# EasyEDA Pro project ProPrj_Wifi-Adapter_2026-02-01.epro

# Schematic Schematic1
Board Name: Board1; Create Date: 2026-01-29; Page Name: P1; Project Name: Wifi-Adapter; Schematic Name: Schematic1; Update Date: 2026-01-30; Company: EasyEDA.com; Page Size: A4; Version: V1.0
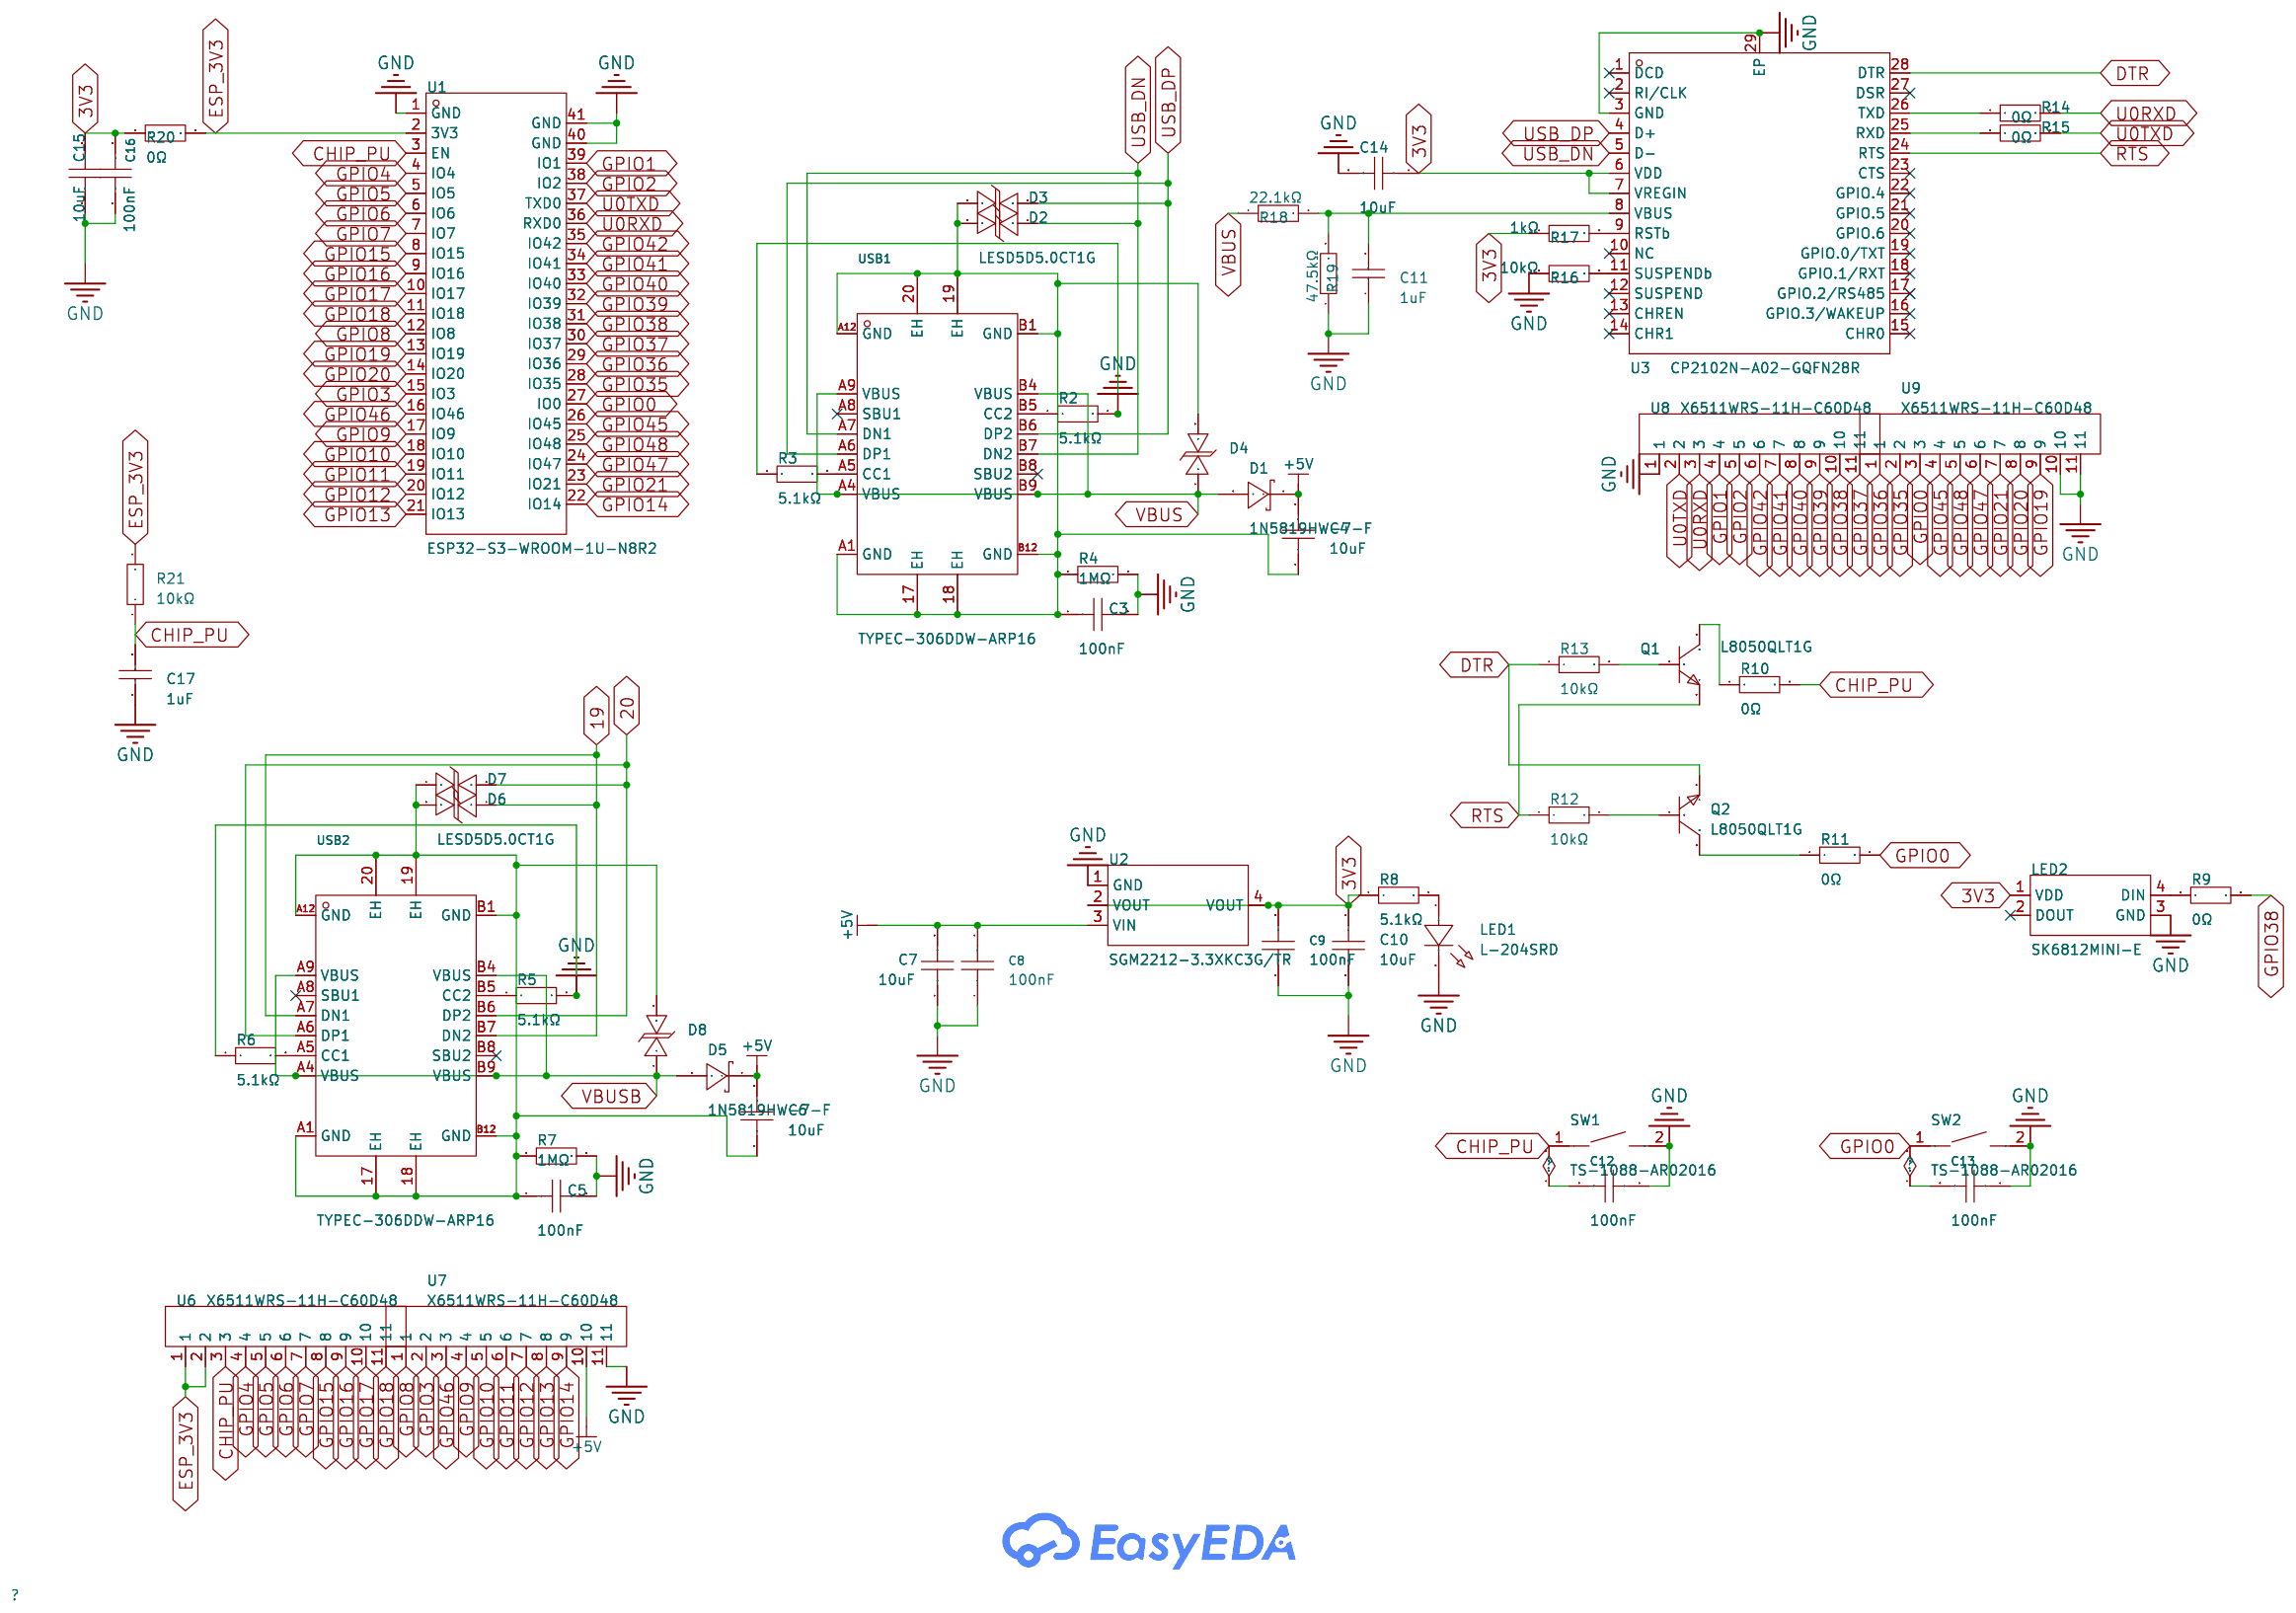
[diagram p0: schematic sheet]

## Parts
C3  100nF  [C0603]
C4  10uF  [C0603]
C5  100nF  [C0603]
C6  10uF  [C0603]
C7  10uF  [C0603]
C8  100nF  [C0603]
C9  100nF  [C0603]
C10  10uF  [C0603]
C11  1uF  [C0603]
C12  100nF  [C0603]
C13  100nF  [C0603]
C14  10uF  [C0603]
C15  10uF  [C0603]
C16  100nF  [C0603]
C17  1uF  [C0603]
D1  1N5819HW-7-F  [SOD-123_L2.7-W1.6-LS3.7-RD]
D2  LESD5D5.0CT1G  [SOD-523_L1.2-W0.8-LS1.6-BI]
D3  LESD5D5.0CT1G  [SOD-523_L1.2-W0.8-LS1.6-BI]
D4  LESD5D5.0CT1G  [SOD-523_L1.2-W0.8-LS1.6-BI]
D5  1N5819HW-7-F  [SOD-123_L2.7-W1.6-LS3.7-RD]
D6  LESD5D5.0CT1G  [SOD-523_L1.2-W0.8-LS1.6-BI]
D7  LESD5D5.0CT1G  [SOD-523_L1.2-W0.8-LS1.6-BI]
D8  LESD5D5.0CT1G  [SOD-523_L1.2-W0.8-LS1.6-BI]
LED1  L-204SRD  [LED-TH_L3.3-W2.4-P2.54-FD_RED]
LED2  SK6812MINI-E  [LED-SMD_L3.2-W2.8-LS5.9_SK6812MINI-E]
Q1  L8050QLT1G  [SOT-23-3_L2.9-W1.3-P1.90-LS2.4-BR]
Q2  L8050QLT1G  [SOT-23-3_L2.9-W1.3-P1.90-LS2.4-BR]
R2  5.1kΩ  [R0603]
R3  5.1kΩ  [R0603]
R4  1MΩ  [R0603]
R5  5.1kΩ  [R0603]
R6  5.1kΩ  [R0603]
R7  1MΩ  [R0603]
R8  5.1kΩ  [R0603]
R9  0Ω  [R0603]
R10  0Ω  [R0603]
R11  0Ω  [R0603]
R12  10kΩ  [R0603]
R13  10kΩ  [R0603]
R14  0Ω  [R0603]
R15  0Ω  [R0603]
R16  10kΩ  [R0603]
R17  1kΩ  [R0603]
R18  22.1kΩ  [R0603]
R19  47.5kΩ  [R0603]
R20  0Ω  [R0603]
R21  10kΩ  [R0603]
SW1  TS-1088-AR02016  [SW-SMD_L3.9-W3.0-P4.45]
SW2  TS-1088-AR02016  [SW-SMD_L3.9-W3.0-P4.45]
U1  ESP32-S3-WROOM-1U-N8R2  [WIRELM-SMD_ESP32-S3-WROOM-1U]
U2  SGM2212-3.3XKC3G/TR  [SOT-223-3_L6.5-W3.4-P2.30-LS7.0-BR]
U3  CP2102N-A02-GQFN28R  [QFN-28_L5.0-W5.0-P0.50-TL-EP3.3]
U6  X6511WRS-11H-C60D48  [HDR-SMD_11P-P2.54-H-M-W13.3-N]
U7  X6511WRS-11H-C60D48  [HDR-SMD_11P-P2.54-H-M-W13.3-N]
U8  X6511WRS-11H-C60D48  [HDR-SMD_11P-P2.54-H-M-W13.3-N]
U9  X6511WRS-11H-C60D48  [HDR-SMD_11P-P2.54-H-M-W13.3-N]
USB1  TYPEC-306DDW-ARP16  [USB-C-TH_TYPEC-306DDW-ARP16]
USB2  TYPEC-306DDW-ARP16  [USB-C-TH_TYPEC-306DDW-ARP16]

## Library data of the parts
C3 C5 = CC0603KRX7R9BB104: Capacitance:100nF Tolerance:±10% Tolerance:±10% Voltage Rating:50V Temperature Coefficient:X7R; LCSC Part Name: 100nF ±10% 50V; Supplier Part: C14663; Manufacturer: YAGEO(国巨); Supplier Footprint: 0603; Datasheet: https://item.szlcsc.com/datasheet/CC0603KRX7R9BB104/15331.html; Supplier: LCSC; Tolerance: ±10%; Voltage Rating: 50V; Temperature Coefficient: X7R
C4 C6 C7 C10 C14 C15 = CC0603MRX5R8BB106: Capacitance:10uF Tolerance:±20% Tolerance:±20% Voltage Rating:25V Temperature Coefficient:X5R; LCSC Part Name: 10uF ±20% 25V; Supplier Part: C596327; Manufacturer: YAGEO(国巨); Supplier Footprint: 0603; Datasheet: https://item.szlcsc.com/datasheet/CC0603MRX5R8BB106/624311.html; Supplier: LCSC; Tolerance: ±20%; Voltage Rating: 25V; Temperature Coefficient: X5R
C8 C9 C12 C13 C16 = CL10B104KB8NNNC: Capacitance:100nF Tolerance:±10% Tolerance:±10% Voltage Rating:50V Temperature Coefficient:X7R; LCSC Part Name: 100nF ±10% 50V; Supplier Part: C1591; Manufacturer: SAMSUNG(三星); Supplier Footprint: 0603; JLCPCB Part Class: Extended Part; Datasheet: https://item.szlcsc.com/datasheet/CL10B104KB8NNNC/1943.html; Supplier: LCSC; Tolerance: ±10%; Voltage Rating: 50V; Temperature Coefficient: X7R
C11 C17 = CL10B105KO8NNNC: Capacitance:1uF Tolerance:±10% Tolerance:±10% Voltage Rating:16V Temperature Coefficient:X7R; LCSC Part Name: 1uF ±10% 16V; Supplier Part: C59782; Manufacturer: SAMSUNG(三星); Supplier Footprint: 0603; Datasheet: https://item.szlcsc.com/datasheet/CL10B105KO8NNNC/60834.html; Supplier: LCSC; Tolerance: ±10%; Voltage Rating: 16V; Temperature Coefficient: X7R
D1 D5 = 1N5819HW-7-F: Diode Configuration:1 Independent Voltage - Forward(Vf@If):450mV@1A Voltage - DC Reverse(Vr):40V Current - Rectified:1A Reverse Leakage Current (Ir):1mA@40V Operating Junction Temperature Range:-65℃~+150℃ Operating Junction Temperature Range:-65℃~+150℃ No; LCSC Part Name: 电压:40V 电流:1A; Supplier Part: C82544; Manufacturer: DIODES(美台); Supplier Footprint: SOD-123; Datasheet: https://item.szlcsc.com/datasheet/1N5819HW-7-F/83701.html; Supplier: LCSC; Diode Configuration: 1 Independent; Voltage - Forward(Vf@If): 450mV@1A; Voltage - DC Reverse(Vr): 40V; Current - Rectified: 1A; Reverse Leakage Current (Ir): 1mA@40V; Operating Junction Temperature Range: -65℃~+150℃; Non-Repetitive Peak Forward Surge Current: 25A
D2-D4 D6-D8 = LESD5D5.0CT1G_C5199850: Supplier Part: C5199850; Manufacturer: UMW(友台半导体); Supplier Footprint: SOD-523; Datasheet: https://atta.szlcsc.com/upload/public/pdf/source/20231109/3A3F4A5EA6FBA8B622F70BA286F4E0C0.pdf; Supplier: LCSC
LED1 = L-204SRD: Lamp Holder Type:1.8mm Tower-shaped Lamp Head Emitted Color:Red Power Dissipation:70mW Forward Current:20mA Dominant Wavelength:645nm Dominant Wavelength:645nm Peak Wavelength:- Diode Configuration:- Lens Color:Foggy red lens Color Temperature:- Color Tem; LCSC Part Name: 红灯; Supplier Part: C2917798; Manufacturer: PARALIGHT(光鼎); Supplier Footprint: 插件,D=1.8mm; Datasheet: https://atta.szlcsc.com/upload/public/pdf/source/20211112/BA2AAE09A121FB6B7F25C10C77270210.pdf; Supplier: LCSC; Lamp Holder Type: 1.8mm Tower-shaped Lamp Head; Emitted Color: Red; Power Dissipation: 70mW; Forward Current: 20mA; Dominant Wavelength: 645nm; Lens Color: Foggy red lens; Viewing Angle: 60°; Operating Temperature: -40℃~+85℃
LED2 = SK6812MINI-E_C5149201: Supplier Part: C5149201; Manufacturer: 欧思科光电; Supplier Footprint: SMD; Datasheet: https://item.szlcsc.com/datasheet/SK6812MINI-E/5773397.html; Supplier: LCSC
Q1 Q2 = L8050QLT1G: type:NPN Current - Collector(Ic):800mA Collector - Emitter Voltage VCEO:25V Pd - Power Dissipation:225mW DC Current Gain:100@100mA,1V DC Current Gain:100@100mA,1V Current - Collector Cutoff:150nA Vce Saturation(VCE(sat)):500mV Operating Temperature:-55℃~+; LCSC Part Name: NPN 电流:800mA 电压:25V; Supplier Part: C49581; Manufacturer: LRC(乐山无线电); Supplier Footprint: SOT-23; Datasheet: https://item.szlcsc.com/datasheet/L8050QLT1G/50589.html; Supplier: LCSC; type: NPN; Current - Collector(Ic): 800mA; Collector - Emitter Voltage VCEO: 25V; Pd - Power Dissipation: 225mW; DC Current Gain: 100@100mA,1V; Current - Collector Cutoff: 150nA; Vce Saturation(VCE(sat)): 500mV; Operating Temperature: -55℃~+150℃; Emitter-Base Voltage(Vebo): 5V
R2 R3 R5 R6 R8 = RT0603BRD075K1L: Type:Thin Film Resistor Resistance: Tolerance:±0.1% Tolerance:±0.1% Power(Watts): Overload Voltage (Max): Temperature Coefficient:±25ppm/℃ Temperature Coefficient:±25ppm/℃ Operating Temperature Range:-55℃~+155℃ Operating Temperature Range:-55℃~+155℃; LCSC Part Name: 薄膜电阻 5.1kΩ ±0.1% 100mW; Supplier Part: C122969; Manufacturer: YAGEO(国巨); Supplier Footprint: 0603; Datasheet: https://atta.szlcsc.com/upload/public/pdf/source/20170728/C122969_1501225761505848820.pdf; Supplier: LCSC; Type: Thin Film Resistor; Tolerance: ±0.1%; Temperature Coefficient: ±25ppm/℃; Operating Temperature Range: -55℃~+155℃
R4 R7 = RC0603FR-071ML: Type:Thick Film Resistors Resistance: Tolerance:±1% Tolerance:±1% Power(Watts): Overload Voltage (Max): Temperature Coefficient:±100ppm/℃ Temperature Coefficient:±100ppm/℃ Operating Temperature Range:-55℃~+155℃ Operating Temperature Range:-55℃~+155℃; LCSC Part Name: 厚膜电阻 1MΩ ±1% 100mW; Supplier Part: C105578; Manufacturer: YAGEO(国巨); Supplier Footprint: 0603; Datasheet: https://atta.szlcsc.com/upload/public/pdf/source/20181102/C105578_67A9388250AF143DE4682E62257D2969.pdf; Supplier: LCSC; Type: Thick Film Resistors; Tolerance: ±1%; Temperature Coefficient: ±100ppm/℃; Operating Temperature Range: -55℃~+155℃
R9-R11 R14 R15 R20 = RC0603FR-070RL: Type:Thick Film Resistors Resistance:0Ω Tolerance:±1% Tolerance:±1% Power(Watts):100mW Voltage-Supply(Max):75V Temperature Coefficient:- Temperature Coefficient:- Operating Temperature:-55℃~+155℃ Operating Temperature:-55℃~+155℃; LCSC Part Name: 厚膜电阻 0Ω ±1% 100mW; Supplier Part: C100044; Manufacturer: YAGEO(国巨); Supplier Footprint: 0603; Datasheet: https://item.szlcsc.com/datasheet/RC0603FR-070RL/101258.html; Supplier: LCSC; Type: Thick Film Resistors; Tolerance: ±1%; Power(Watts): 100mW; Voltage-Supply(Max): 75V; Operating Temperature: -55℃~+155℃
R12 R13 R16 R21 = RC0603FR-0710KL: Type:Thick Film Resistors Resistance: Tolerance:±1% Tolerance:±1% Power(Watts): Overload Voltage (Max): Temperature Coefficient:±100ppm/℃ Temperature Coefficient:±100ppm/℃ Operating Temperature Range:-55℃~+155℃ Operating Temperature Range:-55℃~+155℃; LCSC Part Name: 厚膜电阻 10kΩ ±1% 100mW; Supplier Part: C98220; Manufacturer: YAGEO(国巨); Supplier Footprint: 0603; Datasheet: https://atta.szlcsc.com/upload/public/pdf/source/20180927/C295883_E8D83085EA81BD7DE0B2B681138C15EE.pdf; Supplier: LCSC; Type: Thick Film Resistors; Tolerance: ±1%; Temperature Coefficient: ±100ppm/℃; Operating Temperature Range: -55℃~+155℃
R17 = RC0603FR-071KL: Type:Thick Film Resistor Resistance:1kΩ Tolerance:±1% Tolerance:±1% Power(Watts):100mW Voltage-Supply(Max):75V Temperature Coefficient:±100ppm/℃ Temperature Coefficient:±100ppm/℃ Operating Temperature:-55℃~+155℃ Operating Temperature:-55℃~+155℃; LCSC Part Name: 厚膜电阻 1kΩ ±1% 100mW; Supplier Part: C22548; Manufacturer: YAGEO(国巨); Supplier Footprint: 0603; Datasheet: https://item.szlcsc.com/datasheet/RC0603FR-071KL/23274.html; Supplier: LCSC; Type: Thick Film Resistor; Tolerance: ±1%; Power(Watts): 100mW; Voltage-Supply(Max): 75V; Temperature Coefficient: ±100ppm/℃; Operating Temperature: -55℃~+155℃
R18 = AC0603FR-0722K1L: Type:Thick Film Resistor Resistance:22.1kΩ Tolerance:±1% Tolerance:±1% Power(Watts):100mW Voltage-Supply(Max):75V Temperature Coefficient:±100ppm/℃ Temperature Coefficient:±100ppm/℃ Operating Temperature:-55℃~+155℃ Operating Temperature:-55℃~+155℃; LCSC Part Name: 厚膜电阻 22.1kΩ ±1% 100mW; Supplier Part: C227715; Manufacturer: YAGEO(国巨); Supplier Footprint: 0603; Datasheet: https://item.szlcsc.com/datasheet/AC0603FR-0722K1L/227939.html; Supplier: LCSC; Type: Thick Film Resistor; Tolerance: ±1%; Power(Watts): 100mW; Voltage-Supply(Max): 75V; Temperature Coefficient: ±100ppm/℃; Operating Temperature: -55℃~+155℃
R19 = RC0603FR-0747K5L: Type:Thick Film Resistors Resistance: Tolerance:±1% Tolerance:±1% Power(Watts): Overload Voltage (Max): Temperature Coefficient:±100ppm/℃ Temperature Coefficient:±100ppm/℃ Operating Temperature Range:-55℃~+155℃ Operating Temperature Range:-55℃~+155℃; LCSC Part Name: 厚膜电阻 47.5kΩ ±1% 100mW; Supplier Part: C137715; Manufacturer: YAGEO(国巨); Supplier Footprint: 0603; Datasheet: https://atta.szlcsc.com/upload/public/pdf/source/20180821/C275644_0D56F95EFF785E7D9A1FEF436B37DA78.pdf; Supplier: LCSC; Type: Thick Film Resistors; Tolerance: ±1%; Temperature Coefficient: ±100ppm/℃; Operating Temperature Range: -55℃~+155℃
SW1 SW2 = TS-1088-AR02016: Circuit:SPST Actuator Style:Round Button Operating Force:1.6N Mounting Type:Surface Mount,Vertical Length:4mm Width:3mm Switch Height:2mm with Bracket:Without Bracket Contact Current:50mA Voltage Rating:12V Actuator/Cap Color:Black Termination Style:SMD(S; LCSC Part Name: 4*3*2mm 立贴 轻触开关; Supplier Part: C720477; Manufacturer: XUNPU(讯普); Supplier Footprint: SMD,4x3mm; JLCPCB Part Class: Basic Part; Datasheet: https://item.szlcsc.com/datasheet/TS-1088-AR02016/763484.html; Supplier: LCSC; Circuit: SPST; Actuator Style: Round Button; Operating Force: 1.6N; Mounting Type: Surface Mount,Vertical; Length: 4mm; Width: 3mm; Switch Height: 2mm; with Bracket: Without Bracket; Contact Current: 50mA; Voltage Rating: 12V; Actuator/Cap Color: Black; Termination Style: SMD(SMT) Tab; Life: 100,000 Cycles; Operating Temperature: -30℃~+80℃
U1 = ESP32-S3-WROOM-1U-N8R2: LCSC Part Name: 通用型Wi-Fi+低功耗蓝牙MCU模组; Supplier Part: C3013944; Manufacturer: ESPRESSIF(乐鑫); Supplier Footprint: SMD,19.2x18mm; Datasheet: https://item.szlcsc.com/datasheet/ESP32-S3-WROOM-1U-N8R2/3522414.html; Supplier: LCSC
U2 = SGM2212-3.3XKC3G/TR_C3294699: Output Type:Fixed Voltage - Supply:20V Output Voltage:3.3V Output Voltage:3.3V Output Current:800mA Power Supply Rejection Ratio (PSRR):80dB@(120Hz) Voltage Dropout:450mV@(800mA) standby current:80uA Noise:0.002%Vout Features:Short Circuit Protection；Ther; LCSC Part Name: 800mA、低噪声、低静态电流、高电源抑制比、低压差线性稳压器; Supplier Part: C3294699; Manufacturer: SGMICRO(圣邦微); Supplier Footprint: SOT-223-3; Datasheet: https://item.szlcsc.com/datasheet/SGM2212-3.3XKC3G%252FTR/3859121.html; Supplier: LCSC; Output Type: Fixed; Voltage - Supply: 20V; Output Voltage: 3.3V; Output Current: 800mA; Power Supply Rejection Ratio (PSRR): 80dB@(120Hz); Voltage Dropout: 450mV@(800mA); standby current: 80uA; Noise: 0.002%Vout; Features: Short Circuit Protection；Thermal Shutdown; Operating Temperature: -40℃~+125℃
U3 = CP2102N-A02-GQFN28R: Applications Function:USB to UART USB Protocol:USB 2.0 Voltage - Supply:3V~3.6V Voltage - Supply:3V~3.6V Operating Temperature:-40℃~+85℃@(Ta) Operating Temperature:-40℃~+85℃@(Ta) Current - Supply:9.5mA Supply Current (Iq):1.3uA; Supplier Part: C964632; Manufacturer: SKYWORKS/SILICON LABS(芯科); Supplier Footprint: QFN-28-EP(5x5); Datasheet: https://item.szlcsc.com/datasheet/CP2102N-A02-GQFN28R/1049893.html; Supplier: LCSC; Applications Function: USB to UART; USB Protocol: USB 2.0; Voltage - Supply: 3V~3.6V; Operating Temperature: -40℃~+85℃@(Ta); Current - Supply: 9.5mA; Supply Current (Iq): 1.3uA
U6-U9 = X6511WRS-11H-C60D48: Pin Structure:1x11P Pitch:2.54mm Row Spacing:2.54mm Circluar Pins/Square Pins:Pin Header Number of Rows:1 Number of Pins:11P Current Rating:3A Voltage Rating (Max):250V Length of Mating Pin:- Insulation Height:2.5mm Length of End Connection Pin:- Contact; LCSC Part Name: 1x11P 间距:2.54mm 方针; Supplier Part: C5242204; Manufacturer: XKB Connection(中国星坤); Supplier Footprint: SMD,P=2.54mm,卧贴; Datasheet: https://item.szlcsc.com/datasheet/X6511WRS-11H-C60D48/5950311.html; Supplier: LCSC; Pin Structure: 1x11P; Pitch: 2.54mm; Row Spacing: 2.54mm; Circluar Pins/Square Pins: Pin Header; Number of Rows: 1; Number of Pins: 11P; Current Rating: 3A; Voltage Rating (Max): 250V; Insulation Height: 2.5mm; Contact Material: Brass; Contact Plating: Gold; Operating Temperature: -40℃~+105℃; Color: Black
USB1 USB2 = TYPEC-306DDW-ARP16: Connector Type:Type-C Protocol Standard:USB 3.1 Gender:Female Mounting Type:Right Angle Number of Contacts:16P Number of Ports:1 Current Rating-Power:5A Voltage Rating:- Connect-Disconnect Life:10,000 Cycles Length:8.97mm Detection color:Black Operating T; LCSC Part Name: Type-C 母 弯插; Supplier Part: C2840393; Manufacturer: XUNPU(讯普); Supplier Footprint: 插件; Datasheet: https://item.szlcsc.com/datasheet/TYPEC-306DDW-ARP16/3018856.html; Supplier: LCSC; Connector Type: Type-C; Protocol Standard: USB 3.1; Gender: Female; Mounting Type: Right Angle; Number of Contacts: 16P; Number of Ports: 1; Current Rating-Power: 5A; Connect-Disconnect Life: 10,000 Cycles; Length: 8.97mm; Detection color: Black; Operating Temperature: -45℃~+85℃

## Nets
3V3: C9.2 C10.1 C14.1 C15.2 C16.2 LED2.1(VDD) R8.1 R17.1 R20.1 U2.2(VOUT) U2.4(VOUT) U3.6(VDD) U3.7(VREGIN)
+5V: C4.2 C6.2 C7.2 C8.2 D1.1(K) D5.1(K) U2.3(VIN) U7.10
GND: C3.2 C5.2 C7.1 C8.1 C9.1 C10.2 C11.1 C12.1 C13.1 C14.2 C15.1 C16.1 C17.1 LED1.2(K) LED2.3(GND) R2.2 R3.1 R4.2 R5.2 R6.1 R7.2 R16.1 R19.1 SW1.2 SW2.2 U1.1(GND) U1.40(GND) U1.41(GND) U2.1(GND) U3.3(GND) U3.29(EP) U7.11 U8.1 U9.10 U9.11
VBUS: D1.2(A) D4.1 R18.1 USB1.A4(VBUS) USB1.A9(VBUS) USB1.B4(VBUS) USB1.B9(VBUS)
VBUSB: D5.2(A) D8.1 USB2.A4(VBUS) USB2.A9(VBUS) USB2.B4(VBUS) USB2.B9(VBUS)
19: D6.1 USB2.A7(DN1) USB2.B7(DN2)
20: D7.2 USB2.A6(DP1) USB2.B6(DP2)
CHIP_PU: C12.2 C17.2 R10.2 R21.1 SW1.1 U1.3(EN) U6.3
DTR: Q2.2(E) R13.1 U3.28(DTR)
ESP_3V3: R20.2 R21.2 U1.2(3V3) U6.1 U6.2
GPIO0: C13.2 R11.2 SW2.1 U1.27(IO0) U9.3
GPIO1: U1.39(IO1) U8.4
GPIO2: U1.38(IO2) U8.5
GPIO3: U1.15(IO3) U7.2
GPIO4: U1.4(IO4) U6.4
GPIO5: U1.5(IO5) U6.5
GPIO6: U1.6(IO6) U6.6
GPIO7: U1.7(IO7) U6.7
GPIO8: U1.12(IO8) U7.1
GPIO9: U1.17(IO9) U7.4
GPIO10: U1.18(IO10) U7.5
GPIO11: U1.19(IO11) U7.6
GPIO12: U1.20(IO12) U7.7
GPIO13: U1.21(IO13) U7.8
GPIO14: U1.22(IO14) U7.9
GPIO15: U1.8(IO15) U6.8
GPIO16: U1.9(IO16) U6.9
GPIO17: U1.10(IO17) U6.10
GPIO18: U1.11(IO18) U6.11
GPIO19: U1.13(IO19) U9.9
GPIO20: U1.14(IO20) U9.8
GPIO21: U1.23(IO21) U9.7
GPIO35: U1.28(IO35) U9.2
GPIO36: U1.29(IO36) U9.1
GPIO37: U1.30(IO37) U8.11
GPIO38: R9.2 U1.31(IO38) U8.10
GPIO39: U1.32(IO39) U8.9
GPIO40: U1.33(IO40) U8.8
GPIO41: U1.34(IO41) U8.7
GPIO42: U1.35(IO42) U8.6
GPIO45: U1.26(IO45) U9.4
GPIO46: U1.16(IO46) U7.3
GPIO47: U1.24(IO47) U9.6
GPIO48: U1.25(IO48) U9.5
RTS: Q1.2(E) R12.1 U3.24(RTS)
U0RXD: R14.2 U1.36(RXD0) U8.3
U0TXD: R15.2 U1.37(TXD0) U8.2
USB_DN: D2.1 U3.5(D-) USB1.A7(DN1) USB1.B7(DN2)
USB_DP: D3.2 U3.4(D+) USB1.A6(DP1) USB1.B6(DP2)
$1N1956: R3.2 USB1.A5(CC1)
$1N1958: R2.1 USB1.B5(CC2)
$1N3423: R6.2 USB2.A5(CC1)
$1N3425: R5.1 USB2.B5(CC2)
$1N4060: LED1.1(A) R8.2
$1N4859: Q1.3(C) R10.1
$1N4923: Q2.3(C) R11.1
$1N5061: Q2.1(B) R12.2
$1N5065: Q1.1(B) R13.2
$1N6575: R14.1 U3.26(TXD)
$1N6636: R15.1 U3.25(RXD)
$1N6899: R16.2 U3.11(SUSPENDb)
$1N7000: R17.2 U3.9(RSTb)
$1N7110: C11.2 R18.2 R19.2 U3.8(VBUS)
Net-(C3-1): C3.1 C4.1 D2.2 D3.1 D4.2 R4.1 USB1.17(EH) USB1.18(EH) USB1.19(EH) USB1.20(EH) USB1.A1(GND) USB1.A12(GND) USB1.B1(GND) USB1.B12(GND)
Net-(C5-1): C5.1 C6.1 D6.2 D7.1 D8.2 R7.1 USB2.17(EH) USB2.18(EH) USB2.19(EH) USB2.20(EH) USB2.A1(GND) USB2.A12(GND) USB2.B1(GND) USB2.B12(GND)
Net-(LED2-4): LED2.4(DIN) R9.1

Not connected (* = marked no-connect by the designer): LED2 2(DOUT)*; U3 1(DCD)* 2(RI/CLK)* 10(NC)* 12(SUSPEND)* 13(CHREN)* 14(CHR1)* 15(CHR0)* 16(GPIO.3/WAKEUP)* 17(GPIO.2/RS485)* 18(GPIO.1/RXT)* 19(GPIO.0/TXT)* 20(GPIO.6)* 21(GPIO.5)* 22(GPIO.4)* 23(CTS)* 27(DSR)*; USB1 A8(SBU1)* B8(SBU2)*; USB2 A8(SBU1)* B8(SBU2)*

# Board PCB1
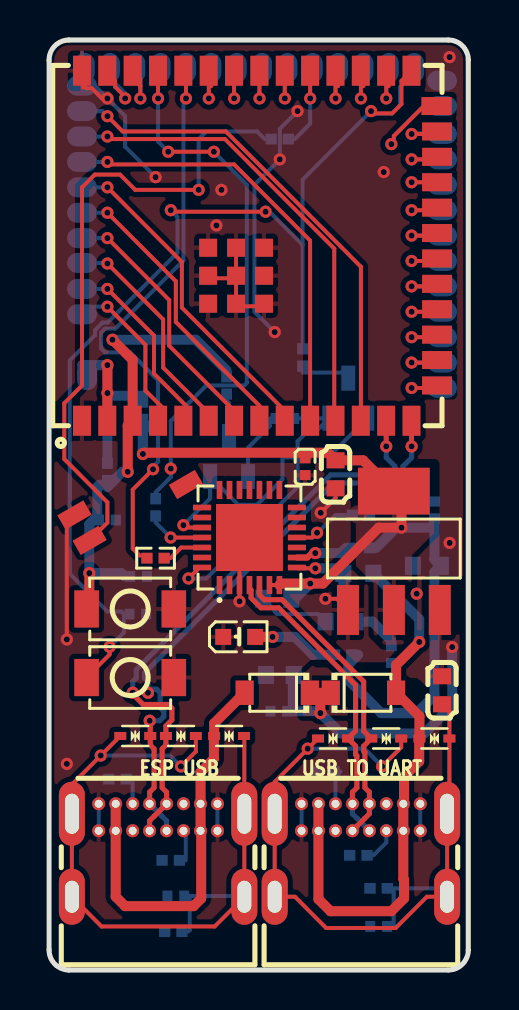
[diagram p1: board, top side]
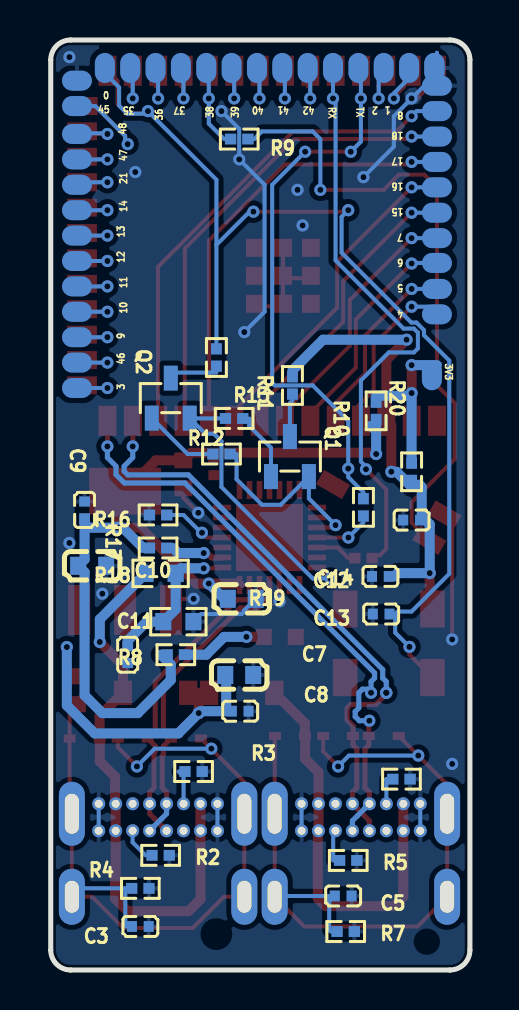
[diagram p2: board, bottom side, seen from below]

Outline 21 x 46.5 mm; copper layers: Top Layer, Bottom Layer. Coordinates in mm from the lower left corner of the outline.
Outline path: 0,45.5 0,1 arc(0.29,0.29) 1,0 20,0 arc(20.71,0.29) 21,1 21,45.5 arc(20.71,46.21) 20,46.5 1,46.5 arc(0.29,46.21) 0,45.5
Stack: Top Layer 0.035mm / Dielectric1 1.51mm FR4 er 4.5 / Bottom Layer 0.035mm

## Design rules (mm)
net USB_DN: DP1
net USB_DP: DP1
net GPIO19: DP2
net GPIO20: DP2
template: Custom Config
spacing copperThickness1oz (default): track to track 0.102, other pairs 0.152 to 0.3
spacing copperThickness2oz: track to track 0.203, other pairs 0.152 to 0.3
track width copperThickness1oz (default): min 0.127, default 0.2, max 2.54
track width copperThickness2oz: min 0.2, default 0.2, max 2.54
differential pair differentialPair (default): width min 0.127, default 0.254, max 2.54; gap min 0.152, default 0.152
via viaSize (default): diameter min 0.5, default 0.61, max 10; hole min 0.3, default 0.305, max 6.3

## Placement (name value [footprint] x y rotation side)
C3  100nF  [C0402]  16.51 2.18 180 bottom
C4  10uF  [C0603]  19.69 13.99 90 top
C5  100nF  [C0402]  6.35 3.7 180 bottom
C7  10uF  [C0603]  11.56 14.75 0 bottom
C8  100nF  [C0402]  11.51 12.94 0 bottom
C9  100nF  [C0402]  19.3 23 270 bottom
C10  10uF  [C0603]  18.92 20.21 180 bottom
C11  1uF  [C0402]  17.15 15.77 90 bottom
C12  100nF  [C0402]  4.48 19.68 180 bottom
C13  100nF  [C0402]  4.44 17.8 180 bottom
C14  10uF  [C0603]  11.43 18.56 180 bottom
C15  10uF  [C0603]  14.35 24.78 90 top
C16  100nF  [C0402]  12.83 25.16 90 top
C17  1uF  [C0402]  2.92 22.5 180 bottom
D1  1N5819HW-7-F  [SOD-123_L2.7-W1.6-LS3.7-RD]  15.75 13.86 0 top
D2  LESD5D5.0CT1G  [SOD-523_L1.2-W0.8-LS1.6-BI]  16.89 11.58 0 top
D3  LESD5D5.0CT1G  [SOD-523_L1.2-W0.8-LS1.6-BI]  14.22 11.58 0 top
D4  LESD5D5.0CT1G  [SOD-523_L1.2-W0.8-LS1.6-BI]  19.3 11.58 0 top
D5  1N5819HW-7-F  [SOD-123_L2.7-W1.6-LS3.7-RD]  11.43 13.86 180 top
D6  LESD5D5.0CT1G  [SOD-523_L1.2-W0.8-LS1.6-BI]  6.6 11.7 0 top
D7  LESD5D5.0CT1G  [SOD-523_L1.2-W0.8-LS1.6-BI]  4.32 11.7 0 top
D8  LESD5D5.0CT1G  [SOD-523_L1.2-W0.8-LS1.6-BI]  9.02 11.7 0 top
LED1  L-204SRD  [LED0603-R-RD_WHITE]  9.53 16.66 0 top
NOREF  -  [Pad_e82]  19.69 40.53 90 top
NOREF#2  -  [Pad_e81]  19.69 41.8 90 top
NOREF#3  -  [Pad_e124]  1.65 42.94 90 top
NOREF#4  -  [Pad_e96]  19.69 31.64 90 top
NOREF#5  -  [Pad_e80]  19.69 43.2 90 top
NOREF#6  -  [Pad_e117]  1.65 34.05 90 top
NOREF#7  -  [Pad_e90]  19.69 34.18 90 top
NOREF#8  -  [Pad_e121]  1.65 39.13 90 top
NOREF#9  -  [Pad_e103]  1.91 29.74 180 top
NOREF#10  -  [Pad_e72]  13.21 45.1 0 top
NOREF#11  -  [Pad_e70]  10.67 45.1 0 top
NOREF#12  -  [Pad_e98]  19.69 29.1 90 top
NOREF#13  -  [Pad_e95]  19.69 32.91 90 top
NOREF#14  -  [Pad_e66]  5.59 45.1 0 top
NOREF#15  -  [Pad_e125]  1.65 44.21 90 top
NOREF#16  -  [Pad_e76]  18.29 45.1 0 top
NOREF#17  -  [Pad_e83]  19.69 39.26 90 top
NOREF#18  -  [Pad_e58]  3.05 45.1 0 top
NOREF#19  -  [Pad_e85]  19.69 36.72 90 top
NOREF#20  -  [Pad_e73]  14.48 45.1 0 top
NOREF#21  -  [Pad_e3]  1.78 45.1 0 top
NOREF#22  -  [Pad_e97]  19.69 30.37 90 top
NOREF#23  -  [Pad_e89]  19.69 35.45 90 top
NOREF#24  -  [Pad_e74]  15.75 45.1 0 top
NOREF#25  -  [Pad_e65]  4.32 45.1 0 top
NOREF#26  -  [Pad_e75]  17.02 45.1 0 top
NOREF#27  -  [Pad_e120]  1.65 37.86 90 top
NOREF#28  -  [Pad_e118]  1.65 35.35 90 top
NOREF#29  -  [Pad_e68]  8.13 45.1 0 top
NOREF#30  -  [Pad_e67]  6.86 45.1 0 top
NOREF#31  -  [Pad_e119]  1.65 36.59 90 top
NOREF#32  -  [Pad_e431]  2.03 21.48 120 top
NOREF#33  -  [Pad_e122]  1.65 40.4 90 top
NOREF#34  -  [Pad_e53]  1.78 45.1 0 top
NOREF#35  -  [Pad_e116]  1.65 32.78 90 top
NOREF#36  -  [Pad_e84]  19.69 37.99 90 top
NOREF#37  -  [Pad_e77]  19.69 44.47 90 top
NOREF#38  -  [Pad_e429]  1.27 22.75 120 top
NOREF#39  -  [Pad_e69]  9.4 45.1 0 top
NOREF#40  -  [Pad_e123]  1.65 41.67 90 top
NOREF#41  -  [Pad_e71]  11.94 45.1 0 top
NOREF#42  -  [Pad_e440]  6.86 24.28 120 top
Q1  L8050QLT1G  [SOT-23-3_L2.9-W1.3-P1.90-LS2.4-BR]  9.02 25.67 270 bottom
Q2  L8050QLT1G  [SOT-23-3_L2.9-W1.3-P1.90-LS2.4-BR]  14.99 28.59 270 bottom
R2  5.1kΩ  [R0402]  15.49 5.73 180 bottom
R3  5.1kΩ  [R0402]  13.84 9.92 0 bottom
R4  1MΩ  [R0402]  16.51 4.08 180 bottom
R5  5.1kΩ  [R0402]  6.1 5.48 180 bottom
R6  5.1kΩ  [R0402]  3.43 9.54 0 bottom
R7  1MΩ  [R0402]  6.22 1.92 180 bottom
R8  5.1kΩ  [R0402]  14.73 15.77 180 bottom
R9  0Ω  [R0402]  11.56 41.55 0 bottom
R10  0Ω  [R0402]  8.89 29.23 90 bottom
R11  0Ω  [R0402]  12.7 30.62 90 bottom
R12  10kΩ  [R0402]  12.45 25.8 0 bottom
R13  10kΩ  [R0402]  11.81 27.58 180 bottom
R14  0Ω  [R0402]  5.33 20.59 180 top
R15  0Ω  [R0402]  5.33 23.13 90 bottom
R16  10kΩ  [R0402]  15.62 22.75 180 bottom
R17  1kΩ  [R0402]  15.62 21.1 180 bottom
R18  22.1kΩ  [R0603]  15.49 19.83 180 bottom
R19  47.5kΩ  [R0603]  14.6 17.42 0 bottom
R20  0Ω  [R0402]  4.7 27.96 90 bottom
R21  10kΩ  [R0402]  2.92 24.91 90 bottom
SW1  TS-1088-AR02016  [SW-SMD_L3.9-W3.0-P4.45]  4.06 18.05 0 top
SW2  TS-1088-AR02016  [SW-SMD_L3.9-W3.0-P4.45]  4.06 14.62 0 top
U1  ESP32-S3-WROOM-1U-N8R2  [WIRELM-SMD_ESP32-S3-WROOM-1U]  10.54 36.21 90 top
U2  SGM2212-3.3XKC3G/TR  [SOT-223-3_L6.5-W3.4-P2.30-LS7.0-BR]  17.27 20.97 270 top
U3  CP2102N-A02-GQFN28R  [QFN-28_L5.0-W5.0-P0.50-TL-EP3.3]  10.04 21.62 90 top
USB1  TYPEC-306DDW-ARP16  [USB-C-TH_TYPEC-306DDW-ARP16]  15.62 5.99 0 top
USB2  TYPEC-306DDW-ARP16  [USB-C-TH_TYPEC-306DDW-ARP16]  5.46 5.99 0 top

## Footprints (pads in the part's own frame, mm; a bottom-side part is the same pattern mirrored in y, then rotated)
C0402
  rect 0.5x0.54 smd: 1(-0.42,0) 2(0.42,0)
C0603
  rect 0.8x0.9 smd: 1(-0.7,0) 2(0.7,0)
LED0603-R-RD_WHITE
  rect 0.8x0.8 smd: 1(0.8,0) 2(-0.8,0)
Pad_e3
  rrect 1x1.5 smd far side: 1(0,0)
Pad_e53
  rrect 1x1.5 smd far side: 1(0,0)
Pad_e58
  rrect 1x1.5 smd far side: 1(0,0)
Pad_e65
  rrect 1x1.5 smd far side: 1(0,0)
Pad_e66
  rrect 1x1.5 smd far side: 1(0,0)
Pad_e67
  rrect 1x1.5 smd far side: 1(0,0)
Pad_e68
  rrect 1x1.5 smd far side: 1(0,0)
Pad_e69
  rrect 1x1.5 smd far side: 1(0,0)
Pad_e70
  rrect 1x1.5 smd far side: 1(0,0)
Pad_e71
  rrect 1x1.5 smd far side: 1(0,0)
Pad_e72
  rrect 1x1.5 smd far side: 1(0,0)
Pad_e73
  rrect 1x1.5 smd far side: 1(0,0)
Pad_e74
  rrect 1x1.5 smd far side: 1(0,0)
Pad_e75
  rrect 1x1.5 smd far side: 1(0,0)
Pad_e76
  rrect 1x1.5 smd far side: 1(0,0)
Pad_e77
  rrect 1x1.5 smd far side: 1(0,0)
Pad_e80
  rrect 1x1.5 smd far side: 1(0,0)
Pad_e81
  rrect 1x1.5 smd far side: 1(0,0)
Pad_e82
  rrect 1x1.5 smd far side: 1(0,0)
Pad_e83
  rrect 1x1.5 smd far side: 1(0,0)
Pad_e84
  rrect 1x1.5 smd far side: 1(0,0)
Pad_e85
  rrect 1x1.5 smd far side: 1(0,0)
Pad_e89
  rrect 1x1.5 smd far side: 1(0,0)
Pad_e90
  rrect 1x1.5 smd far side: 1(0,0)
Pad_e95
  rrect 1x1.5 smd far side: 1(0,0)
Pad_e96
  rrect 1x1.5 smd far side: 1(0,0)
Pad_e97
  rrect 1x1.5 smd far side: 1(0,0)
Pad_e98
  rrect 1x1.5 smd far side: 1(0,0)
Pad_e103
  rrect 1x1.5 smd far side: 1(0,0)
Pad_e116
  rrect 1x1.5 smd far side: 1(0,0)
Pad_e117
  rrect 1x1.5 smd far side: 1(0,0)
Pad_e118
  rrect 1x1.5 smd far side: 1(0,0)
Pad_e119
  rrect 1x1.5 smd far side: 1(0,0)
Pad_e120
  rrect 1x1.5 smd far side: 1(0,0)
Pad_e121
  rrect 1x1.5 smd far side: 1(0,0)
Pad_e122
  rrect 1x1.5 smd far side: 1(0,0)
Pad_e123
  rrect 1x1.5 smd far side: 1(0,0)
Pad_e124
  rrect 1x1.5 smd far side: 1(0,0)
Pad_e125
  rrect 1x1.5 smd far side: 1(0,0)
Pad_e429
  rect 0.82x1.5 smd: 1(0,0)
Pad_e431
  rect 0.82x1.5 smd: 1(0,0)
Pad_e440
  rect 0.82x1.5 smd: 3V3(0,0)
QFN-28_L5.0-W5.0-P0.50-TL-EP3.3
  rect 0.905x0.28 smd: 1(-2.377,1.5) 2(-2.377,1) 3(-2.377,0.5) 4(-2.377,0) 5(-2.377,-0.5) 6(-2.377,-1) 7(-2.377,-1.5) 15(2.377,-1.5) 16(2.377,-1) 17(2.377,-0.5) 18(2.377,0) 19(2.377,0.5) 20(2.377,1) 21(2.377,1.5)
  rect 0.28x0.905 smd: 8(-1.5,-2.377) 9(-1,-2.377) 10(-0.5,-2.377) 11(0,-2.377) 12(0.5,-2.377) 13(1,-2.377) 14(1.5,-2.377) 22(1.5,2.377) 23(1,2.377) 24(0.5,2.377) 25(0,2.377) 26(-0.5,2.377) 27(-1,2.377) 28(-1.5,2.377)
  rect 3.35x3.35 smd: 29(0,0)
R0402
  rect 0.566x0.54 smd: 1(-0.433,0) 2(0.433,0)
R0603
  rect 0.806x0.864 smd: 1(-0.753,0) 2(0.753,0)
SOD-123_L2.7-W1.6-LS3.7-RD
  rect 0.91x1.22 smd: 1(-1.635,0) 2(1.635,0)
SOD-523_L1.2-W0.8-LS1.6-BI
  rect 0.6x0.4 smd: 1(-0.75,0) 2(0.75,0)
SOT-23-3_L2.9-W1.3-P1.90-LS2.4-BR
  rect 1.25x0.7 smd: 1(1,-0.95) 2(1,0.95) 3(-1,0)
SOT-223-3_L6.5-W3.4-P2.30-LS7.0-BR
  rect 2.5x1.1 smd: 1(2.97,-2.3) 2(2.97,0) 3(2.97,2.3)
  rect 2.34x3.6 smd: 4(-2.97,0)
SW-SMD_L3.9-W3.0-P4.45
  rect 1.23x1.86 smd: 1(-2.185,0) 2(2.185,0)
USB-C-TH_TYPEC-306DDW-ARP16
  oval 1.3x3.2 hole 0.7x2: 17(4.32,1.825) 20(-4.32,1.825)
  oval 1.3x2.8 hole 0.7x1.6: 18(4.32,-2.325) 19(-4.32,-2.325)
  round 0.65 hole 0.4: A1(-2.975,2.325) A4(-2.125,2.325) A5(-1.275,2.325) A6(-0.425,2.325) A7(0.425,2.325) A8(1.275,2.325) A9(2.125,2.325) A12(2.975,2.325) B1(2.975,0.975) B4(2.125,0.975) B5(1.275,0.975) B6(0.425,0.975) B7(-0.425,0.975) B8(-1.275,0.975) B9(-2.125,0.975) B12(-2.975,0.975)
WIRELM-SMD_ESP32-S3-WROOM-1U
  rect 1.5x0.9 smd: 1(-8.75,8.895) 2(-8.75,7.625) 3(-8.75,6.355) 4(-8.75,5.085) 5(-8.75,3.815) 6(-8.75,2.545) 7(-8.75,1.275) 8(-8.75,0.005) 9(-8.75,-1.265) 10(-8.75,-2.535) 11(-8.75,-3.805) 12(-8.75,-5.075) 13(-8.75,-6.345) 14(-8.75,-7.615) 27(8.75,-7.615) 28(8.75,-6.345) 29(8.75,-5.075) 30(8.75,-3.805) 31(8.75,-2.535) 32(8.75,-1.265) 33(8.75,0.005) 34(8.75,1.275) 35(8.75,2.545) 36(8.75,3.815) 37(8.75,5.085) 38(8.75,6.355) 39(8.75,7.625) 40(8.75,8.895)
  rect 0.9x1.5 smd: 15(-6.985,-8.895) 16(-5.715,-8.895) 17(-4.445,-8.895) 18(-3.175,-8.895) 19(-1.905,-8.895) 20(-0.635,-8.895) 21(0.635,-8.895) 22(1.905,-8.895) 23(3.175,-8.895) 24(4.445,-8.895) 25(5.715,-8.895) 26(6.985,-8.865)
  rect 0.9x0.9 smd: 41(-2.9,2.575) 41(-2.9,1.175) 41(-2.9,-0.225) 41(-1.5,2.575) 41(-1.5,1.175) 41(-1.5,-0.225) 41(-0.1,2.575) 41(-0.1,1.175) 41(-0.1,-0.225)

## Nets
3V3: C9.2 C10.1 C14.1 C15.2 C16.2 R8.1 R17.1 R20.1 U2.2 U2.4 U3.6 U3.7
+5V: C4.2 C7.2 C8.2 D1.1 D5.1 U2.3
GND: C3.2 C5.2 C7.1 C8.1 C9.1 C10.2 C11.1 C12.1 C13.1 C14.2 C15.1 C16.1 C17.1 LED1.2 NOREF#15.1 NOREF#21.1 NOREF#34.1 NOREF#37.1 NOREF#38.1 R2.2 R3.1 R4.2 R5.2 R6.1 R7.2 R16.1 R19.1 SW1.2 SW2.2 U1.1 U1.40 U1.41 U2.1 U3.3 U3.29 USB1.A1 USB1.A12 USB1.B1 USB1.B12 USB2.A1 USB2.A12 USB2.B1 USB2.B12
VBUS: D1.2 D4.1 R18.1 USB1.A4 USB1.A9 USB1.B4 USB1.B9
VBUSB: D5.2 D8.1 USB2.A4 USB2.A9 USB2.B4 USB2.B9
CHIP_PU: C12.2 C17.2 R10.2 R21.1 SW1.1 U1.3
DTR: Q2.2 R13.1 U3.28
ESP_3V3: NOREF#9.1 R20.2 R21.2 U1.2
GPIO0: C13.2 NOREF#16.1 R11.2 SW2.1 U1.27
GPIO1: NOREF#18.1 U1.39
GPIO2: NOREF#25.1 U1.38
GPIO3: NOREF#12.1 U1.15
GPIO4: NOREF#35.1 U1.4
GPIO5: NOREF#6.1 U1.5
GPIO6: NOREF#28.1 U1.6
GPIO7: NOREF#31.1 U1.7
GPIO8: NOREF#3.1 U1.12
GPIO9: NOREF#4.1 U1.17
GPIO10: NOREF#13.1 U1.18
GPIO11: NOREF#7.1 U1.19
GPIO12: NOREF#23.1 U1.20
GPIO13: NOREF#19.1 U1.21
GPIO14: NOREF#36.1 U1.22
GPIO15: NOREF#27.1 U1.8
GPIO16: NOREF#8.1 U1.9
GPIO17: NOREF#33.1 U1.10
GPIO18: NOREF#40.1 U1.11
GPIO19: D6.1 U1.13 USB2.A7 USB2.B7
GPIO20: D7.2 U1.14 USB2.A6 USB2.B6
GPIO21: NOREF#17.1 U1.23
GPIO35: NOREF#26.1 U1.28
GPIO36: NOREF#24.1 U1.29
GPIO37: NOREF#20.1 U1.30
GPIO38: NOREF#10.1 R9.2 U1.31
GPIO39: NOREF#41.1 U1.32
GPIO40: NOREF#11.1 U1.33
GPIO41: NOREF#39.1 U1.34
GPIO42: NOREF#29.1 U1.35
GPIO45: NOREF#5.1 U1.26
GPIO46: NOREF#22.1 U1.16
GPIO47: NOREF.1 U1.24
GPIO48: NOREF#2.1 U1.25
RTS: Q1.2 R12.1 U3.24
U0RXD: NOREF#30.1 R14.2 U1.36
U0TXD: NOREF#14.1 R15.2 U1.37
USB_DN: D2.1 U3.5 USB1.A7 USB1.B7
USB_DP: D3.2 U3.4 USB1.A6 USB1.B6
$1N1120: C3.1 C4.1 D2.2 D3.1 D4.2 R4.1 USB1.17 USB1.18 USB1.19 USB1.20
$1N1956: R3.2 USB1.A5
$1N1958: R2.1 USB1.B5
$1N3399: C5.1 D6.2 D7.1 D8.2 R7.1 USB2.17 USB2.18 USB2.19 USB2.20
$1N3423: R6.2 USB2.A5
$1N3425: R5.1 USB2.B5
$1N4060: LED1.1 R8.2
$1N4755: NOREF#32.1 R9.1
$1N4859: Q1.3 R10.1
$1N4923: Q2.3 R11.1
$1N5061: Q2.1 R12.2
$1N5065: Q1.1 R13.2
$1N6575: R14.1 U3.26
$1N6636: R15.1 U3.25
$1N6899: R16.2 U3.11
$1N7000: R17.2 U3.9
$1N7110: C11.2 R18.2 R19.2 U3.8

Pads without a net: NOREF#42 3V3; U3 1 2 10 12 13 14 15 16 17 18 19 20 21 22 23 27; USB1 A8 B8; USB2 A8 B8

## Via types
v1: diameter 0.61, hole 0.305, Top Layer to Bottom Layer, 86 vias

## Routing (per net, layer and track width the routed paths; a pad name or vN(x,y) marks a point on that pad's centre or on a via; arc(x,y) is an arc through that point)
3V3: length 45.3
  Top Layer w0.2: U3.6 U3.7
  Top Layer w0.5: U3.7 11.61,19.32 v1(13.08,19.32) 13.72,19.32 16.51,22.12 v1(17.65,22.12) 17.65,23.56 U2.4 15.73,25.48 C15.2 13.97,25.86 4.76,25.86 v1(4.7,25.8)
  Bottom Layer w0.5: 16.37,21.1 17.39,22.12 v1(17.65,22.12) 19.12,22.12 19.3,22.31 19.3,20.53 C10.1 19.3,19.89 19.3,13.73 18.41,12.84 16.64,12.84 14.99,14.5 14.99,15.27 15.49,15.77 ; v1(4.7,25.8) 4.7,26.95 4.95,27.2 4.7,27.2 ; v1(13.08,19.32) 12.32,18.56 C14.1
+5V: length 15.6
  Top Layer w0.5: v1(13.59,12.84) 13.59,13.61 ; D5.1 D1.1
  Bottom Layer w0.5: v1(20.19,16.15) 20.19,13.23 18.8,11.83 14.6,11.83 v1(13.59,12.84) 13.49,12.94 12.21,12.94 12.21,14.7 12.26,14.75
GND: length 50.1
  Top Layer w0.2: 1.77,44.2 1.76,44.19 ; 1.76,44.19 1.58,44.36 1.58,44.9 ; 1.76,44.19 1.85,44.09 2.14,44.09 2.65,43.58 v1(2.92,43.58) ; 1.76,44.19 1.71,44.13 ; 9.37,34.59 7.97,34.59 ; 9.37,34.59 9.37,33.19 10.77,33.19 ; 9.37,34.59 9.37,35.99 ; v1(9.54,18.43) U3.3 9.54,21.12 U3.29 ; C15.1 14.35,23.6 v1(13.61,22.86) ; NOREF#38.1 0.89,22.37 v1(0.89,16.53) ; U2.1 14.41,18.56 v1(13.84,18.56)
  Bottom Layer w0.2: C14.2 11.3,17.99 11.3,17.92 11.43,17.8 13.47,17.8 R19.1 ; USB2.B12 USB2.A1 ; v1(11.3,31.89) 10.29,32.91 10.29,39.26 v1(11.56,40.53) 11.56,42.06 v1(12.45,42.94) ; USB1.B12 USB1.A1 ; v1(5.33,39.64) 3.81,41.17 3.81,42.69 v1(2.92,43.58) 2.29,44.21 NOREF#15.1 1.65,45.87 ; USB2.B1 USB2.A12 ; USB1.B1 USB1.A12
  vias: v1(0.89,10.31) v1(8.38,37.23) v1(8.64,39.01) v1(16.76,39.9) v1(18.41,18.81) v1(20.06,45.64) v1(20.07,21.35)
VBUS: length 27.9
  Top Layer w0.5: USB1.A4 USB1.B9 13.5,3.54 14.1,2.94 17.15,2.94 17.78,3.57 17.78,4.52 17.75,4.55 USB1.B4 USB1.A9 17.78,8.35 17.78,9.67 18.54,10.43 18.54,11.56 D4.1 18.55,12.69 D1.2 17.38,15.24 18.41,16.27
  Bottom Layer w0.5: v1(18.54,16.4) 18.54,17.54 R18.1
VBUSB: length 20.5
  Top Layer w0.5: USB2.A4 USB2.B9 3.34,3.67 3.81,3.19 7.24,3.19 7.62,3.57 7.62,6.93 USB2.B4 USB2.A9 7.59,9.89 8.25,10.56 8.25,11.69 D8.1 8.27,12.33 9.79,13.86
CHIP_PU: length 23.6
  Top Layer w0.5: SW1.1 2.01,18.19 v1(2.01,19.84) ; v1(3.18,31.51) 4.19,30.5 U1.3 3.94,27.21 v1(3.94,24.91)
  Bottom Layer w0.5: 3.78,19.68 3.62,19.84 v1(2.01,19.84) 2.01,22.29 2.41,22.69 2.41,24.15 2.52,24.26 2.82,24.26 2.92,24.16 3.67,24.91 v1(3.94,24.91) ; 8.89,29.98 7.36,31.51 v1(3.18,31.51)
DTR: length 14.1
  Top Layer w0.2: U3.28 7.53,20.12 v1(6.98,19.58)
  Bottom Layer w0.2: 14.02,27.58 13.26,26.81 12.83,26.81 12.45,26.43 12.45,24.15 7.87,19.58 v1(6.98,19.58) ; 14.02,27.58 12.56,27.58 ; 14.02,27.58 Q2.2
ESP_3V3: length 9.1
  Top Layer w0.5: U1.2 2.92,28.84 v1(2.92,28.85) v1(2.92,30.24)
  Bottom Layer w0.5: 2.92,25.66 v1(2.92,28.85) 3.06,28.71 4.7,28.71 ; v1(2.92,30.24) 1.65,30.24
GPIO0: length 55.7
  Top Layer w0.2: v1(6.1,37.99) 6.17,37.91 v1(10.85,37.91) ; SW2.1 3.03,15.77 v1(3.03,16.16) ; v1(16.13,42.94) 16.24,42.83 17.19,42.83 17.65,43.3 17.65,44.46 U1.27
  Bottom Layer w0.2: 12.7,36.25 11.04,37.91 v1(10.85,37.91) ; 12.7,36.25 12.7,39.52 v1(16.13,42.94) 16.26,42.82 17.17,42.82 17.57,43.22 17.57,44.14 18.29,44.85 ; 12.7,36.25 12.7,31.38 ; v1(6.1,37.99) 6.43,37.66 6.43,35.87 2.94,32.37 2.68,32.37 2.3,32 2.3,31.74 1.03,30.47 1.03,19.81 2.92,17.92 3.62,17.92 3.75,17.8 3.75,16.87 v1(3.03,16.16)
GPIO1: length 3.3
  Top Layer w0.2: 3.04,44.58 3.04,44.45 ; v1(3.81,43.58) 3.81,43.66 3.3,44.16 3.3,44.45 2.92,44.84
  Bottom Layer w0.2: v1(3.81,43.58) 3.81,43.83 2.92,44.72
GPIO2: length 3.7
  Top Layer w0.2: 4.57,44.2 v1(4.57,43.58) ; 4.57,44.2 4.57,44.58 ; 4.57,44.2 4.19,44.58
  Bottom Layer w0.2: 4.57,44.85 4.57,45.23 ; 4.57,44.85 4.7,44.72 ; 4.57,44.85 NOREF#25.1 ; 4.57,44.85 v1(4.57,43.58)
GPIO3: length 3.4
  Top Layer w0.2: v1(18.16,29.1) 19.31,29.1 U1.15
  Bottom Layer w0.2: v1(18.16,29.1) 20.19,29.1
GPIO4: length 8.4
  Top Layer w0.2: U1.4 5.71,27.72 5.71,28.09 4.83,28.97 4.83,31.26 v1(2.92,33.17)
  Bottom Layer w0.2: v1(2.92,33.17) 2.03,33.17 NOREF#35.1
GPIO5: length 9.5
  Top Layer w0.2: v1(2.92,34.05) 5.25,31.72 5.25,29.81 6.85,28.22 6.85,27.59 U1.5
  Bottom Layer w0.2: v1(2.92,34.05) NOREF#6.1
GPIO6: length 11.2
  Top Layer w0.2: v1(2.92,35.32) 5.72,32.53 5.72,30.12 8,27.84 U1.6
  Bottom Layer w0.2: v1(2.92,35.32) 2.89,35.35 NOREF#28.1
GPIO7: length 13
  Top Layer w0.2: v1(2.92,36.59) 6.02,33.5 6.02,31.21 9.27,27.96 U1.7
  Bottom Layer w0.2: v1(2.92,36.59) NOREF#31.1
GPIO8: length 24.9
  Top Layer w0.2: U1.12 15.62,27.47 15.62,35.16 8.85,41.93 3.68,41.93 v1(2.92,42.69)
  Bottom Layer w0.2: v1(2.92,42.69) 2.67,42.94 NOREF#3.1
GPIO9: length 3.4
  Top Layer w0.2: U1.17 19.31,31.64 v1(18.16,31.64)
  Bottom Layer w0.2: v1(18.16,31.64) 20.19,31.64
GPIO10: length 3.4
  Top Layer w0.2: v1(18.16,32.91) 19.31,32.91 U1.18
  Bottom Layer w0.2: v1(18.16,32.91) 20.19,32.91
GPIO11: length 3.5
  Top Layer w0.2: U1.19 19.31,34.18 v1(18.16,34.18)
  Bottom Layer w0.2: v1(18.16,34.18) 20.32,34.18
GPIO12: length 3.4
  Top Layer w0.2: v1(18.16,35.45) 19.31,35.45 U1.20
  Bottom Layer w0.2: v1(18.16,35.45) 20.19,35.45
GPIO13: length 3.4
  Top Layer w0.2: v1(18.16,36.72) 19.31,36.72 U1.21
  Bottom Layer w0.2: v1(18.16,36.72) 20.19,36.72
GPIO14: length 3.4
  Top Layer w0.2: U1.22 19.31,37.99 v1(18.16,37.99)
  Bottom Layer w0.2: v1(18.16,37.99) 20.19,37.99
GPIO15: length 14.8
  Top Layer w0.2: U1.8 10.54,28.22 6.35,32.4 6.35,34.44 v1(2.92,37.86)
  Bottom Layer w0.2: v1(2.92,37.86) NOREF#27.1
GPIO16: length 16.6
  Top Layer w0.2: v1(2.92,39.13) 6.65,35.4 6.65,33.12 11.81,27.96 U1.9
  Bottom Layer w0.2: v1(2.92,39.13) NOREF#8.1
GPIO17: length 22.1
  Top Layer w0.2: v1(2.92,40.4) 3.05,40.28 9.27,40.28 13.08,36.47 U1.10
  Bottom Layer w0.2: v1(2.92,40.4) NOREF#33.1
GPIO18: length 23.6
  Top Layer w0.2: U1.11 14.35,27.84 14.29,27.9 14.29,36.07 8.81,41.55 3.05,41.55 v1(2.92,41.67)
  Bottom Layer w0.2: v1(2.92,41.67) NOREF#40.1
GPIO19: length 30.1
  Top Layer w0.254: v1(4.19,13.86) 4.19,13.8 4.71,13.28 5.97,13.28 6.15,13.09 6.15,12.5 5.85,12.2 D6.1 5.85,11.25 5.66,11.06 5.66,9.11 5.89,8.89 USB2.A7 5.64,8.07 5.64,8.06 5.29,7.71 5.28,7.71 5.04,7.46 USB2.B7 ; v1(16.89,26.18) 16.89,26.19 U1.13
  Bottom Layer w0.254: v1(16.89,26.18) 16.89,25.62 17.32,25.19 17.32,24.94 17.14,24.76 14.1,24.76 4.37,15.02 4.37,14.6 4.19,14.42 v1(4.19,13.86)
GPIO20: length 29.9
  Top Layer w0.254: USB2.A6 5.04,8.89 5.26,9.11 5.26,11.06 5.07,11.25 D7.2 5.07,12.44 v1(5.04,12.46) ; U1.14 18.16,26.35 18.16,26.35 v1(18.16,26.18)
  Bottom Layer w0.254: v1(5.04,12.46) 5.54,12.46 5.75,12.67 5.75,12.92 5.57,13.1 5.57,13.86 5.39,14.04 5.13,14.04 v1(4.95,13.86) 4.95,14.42 4.78,14.6 4.78,14.85 14.27,24.35 17.31,24.35 17.73,24.77 17.73,25.19 18.16,25.62 v1(18.16,26.18) ; USB2.A6 5.28,8.07 5.28,8.06 5.64,7.71 5.64,7.71 5.89,7.46 USB2.B6
GPIO21: length 3.4
  Top Layer w0.2: U1.23 v1(18.16,39.39)
  Bottom Layer w0.2: 20.19,39.26 20.07,39.39 v1(18.16,39.39)
GPIO35: length 3
  Top Layer w0.2: 17.01,44.2 17.02,44.2 ; 16.89,44.96 v1(16.89,43.58)
  Bottom Layer w0.2: NOREF#26.1 16.89,44.98 v1(16.89,43.58)
GPIO36: length 3
  Top Layer w0.2: 15.74,44.2 15.75,44.2 ; 15.62,44.96 v1(15.62,43.58)
  Bottom Layer w0.2: v1(15.62,43.58) 15.62,44.98 NOREF#24.1
GPIO37: length 3
  Top Layer w0.2: 14.47,44.2 14.48,44.2 ; 14.35,44.96 v1(14.35,43.58)
  Bottom Layer w0.2: v1(14.35,43.58) 14.35,44.98 NOREF#20.1
GPIO38: length 5.3
  Top Layer w0.2: v1(13.08,43.58) 13.08,43.58 U1.31
  Bottom Layer w0.2: 12.31,41.55 13.08,42.32 v1(13.08,43.58) 13.08,44.98 NOREF#10.1
GPIO39: length 3
  Top Layer w0.2: U1.32 11.81,43.58 v1(11.81,43.58)
  Bottom Layer w0.2: NOREF#41.1 11.81,44.98 v1(11.81,43.58)
GPIO40: length 3
  Top Layer w0.2: v1(10.54,43.58) 10.54,43.58 U1.33
  Bottom Layer w0.2: NOREF#11.1 10.54,44.98 v1(10.54,43.58)
GPIO41: length 3
  Top Layer w0.2: v1(9.27,43.58) 9.27,43.58 U1.34
  Bottom Layer w0.2: v1(9.27,43.58) 9.27,44.98 NOREF#39.1
GPIO42: length 3
  Top Layer w0.2: 8,44.96 v1(8,43.58) ; 8.12,44.2 8.13,44.2
  Bottom Layer w0.2: NOREF#29.1 8,44.98 v1(8,43.58)
GPIO45: length 7.2
  Top Layer w0.2: v1(17.15,41.29) 17.27,41.42 17.27,41.7 18.77,43.2 U1.26
  Bottom Layer w0.2: v1(17.15,41.29) 17.27,41.42 17.27,41.7 18.77,43.2 20.19,43.2
GPIO46: length 3.4
  Top Layer w0.2: v1(18.16,30.37) 19.31,30.37 U1.16
  Bottom Layer w0.2: v1(18.16,30.37) 20.19,30.37
GPIO47: length 3.4
  Top Layer w0.2: U1.24 19.31,40.53 v1(18.16,40.53)
  Bottom Layer w0.2: v1(18.16,40.53) 20.19,40.53
GPIO48: length 3.4
  Top Layer w0.2: v1(18.16,41.8) 19.31,41.8 U1.25
  Bottom Layer w0.2: v1(18.16,41.8) 18.2,41.84 20.16,41.84 20.19,41.8
RTS: length 10
  Top Layer w0.2: v1(6.73,22.24) 6.85,22.12 U3.24
  Bottom Layer w0.2: v1(6.73,22.24) 8.07,23.58 Q1.2 9.48,23.26 10.41,23.26 11.69,24.54 11.69,25.8
U0RXD: length 30.8
  Top Layer w0.2: v1(5.21,25.04) 4.19,24.02 4.19,21.07 4.54,20.72 ; 6.98,44.45 6.86,44.58 6.86,44.2 ; 6.86,44.2 6.85,44.2 ; 6.86,44.2 v1(6.86,43.58)
  Bottom Layer w0.2: v1(5.21,25.04) 5.21,25.16 5.46,25.42 5.46,29.48 4.06,30.88 2.81,30.88 2.61,31.08 2.61,31.87 2.81,32.07 3.32,32.07 6.73,35.48 6.73,43.45 v1(6.86,43.58) NOREF#30.1 ; NOREF#30.1 6.86,45.48 ; NOREF#30.1 6.98,44.98
U0TXD: length 28.8
  Top Layer w0.2: v1(8.25,40.91) v1(5.97,40.91) ; v1(5.46,43.58) 5.46,43.58 U1.37
  Bottom Layer w0.2: 5.33,23.89 6.1,24.65 v1(6.1,25.07) 6.1,27.45 7.87,29.23 9.78,29.23 9.91,29.36 9.91,39.26 v1(8.25,40.91) ; NOREF#14.1 5.46,44.98 v1(5.46,43.58) 5.46,41.42 v1(5.97,40.91)
USB_DN: length 15.8
  Top Layer w0.254: USB1.B7 15.44,7.21 15.44,7.21 15.8,7.57 15.8,7.57 16.05,7.81 USB1.A7 16.05,8.89 15.82,9.11 15.82,10.88 15.76,10.94 15.76,11.19 D2.1 15.76,11.96 15.76,14.42 11.67,18.52 10.78,18.52 10.54,18.76 U3.5
USB_DP: length 15.8
  Top Layer w0.254: U3.4 10.04,19.08 10.12,19 10.12,18.6 10.62,18.11 11.5,18.11 15.35,14.25 15.35,11.96 D3.2 15.35,11.19 15.35,10.77 15.42,10.71 15.42,9.11 15.2,8.89 USB1.A6
  Bottom Layer w0.254: USB1.A6 15.2,7.81 15.44,7.57 15.45,7.57 15.8,7.21 15.8,7.21 USB1.B6
$1N1120: length 39.3
  Top Layer w0.2: v1(12.95,11.07) 12.95,11.06 ; 12.95,11.06 D3.1 ; 12.95,11.06 11.3,9.4 USB1.20 USB1.19 12.32,3.66 13.88,2.1 17.36,2.1 18.93,3.66 USB1.18 USB1.17 20.05,7.92 D4.2 20.05,12.92 C4.1 ; v1(16.68,10.18) 17.64,11.14 D2.2
  Bottom Layer w0.2: USB1.18 19.52,4.08 17.26,4.08 17.26,2.23 17.21,2.18 ; v1(12.95,11.07) 15.79,11.07 v1(16.68,10.18)
$1N1956: length 1.7
  Bottom Layer w0.2: 14.6,9.92 14.35,9.67 USB1.A5
$1N1958: length 1.5
  Bottom Layer w0.2: USB1.B5 16.9,6.38 16.25,5.73
$1N3399: length 37.6
  Top Layer w0.2: D7.1 v1(2.59,10.72) 1.14,9.28 USB2.20 USB2.19 2.63,2.18 8.3,2.18 USB2.18 USB2.17 9.78,11.69 D8.2 ; v1(6.6,10.18) 7.35,10.93 D6.2
  Bottom Layer w0.2: 6.98,1.92 7.05,2 7.05,3.7 9.74,3.7 USB2.18 ; v1(6.6,10.18) 6.06,10.72 v1(2.59,10.72)
$1N3423: length 1.2
  Bottom Layer w0.2: USB2.A5 4.19,9.54 4.18,9.54
$1N3425: length 1.5
  Bottom Layer w0.2: USB2.B5 6.85,6.85 6.85,5.48
$1N4060: length 4
  Top Layer w0.5: LED1.1 v1(11.2,16.66)
  Bottom Layer w0.5: 13.98,15.77 13.21,15.77 12.32,16.66 v1(11.2,16.66)
$1N4755: length 31.9
  Top Layer w0.2: v1(7.49,39.01) 4.32,39.01 3.56,39.77 2.29,39.77 1.65,39.13 1.65,29.23 0.76,28.34 0.76,25.55 2.92,23.39 2.92,22.37 NOREF#32.1
  Bottom Layer w0.2: v1(7.49,39.01) 7.49,41.55 7.87,41.93 10.42,41.93 10.8,41.55
$1N4859: length 1.9
  Bottom Layer w0.2: Q1.3 9.02,28.35 8.89,28.47
$1N4923: length 2.4
  Bottom Layer w0.2: 12.7,29.87 14.71,29.87 Q2.3
$1N5061: length 3.5
  Bottom Layer w0.2: Q2.1 14.14,25.8 13.2,25.8
$1N5065: length 3.4
  Bottom Layer w0.2: Q1.1 9.97,26.11 11.06,27.2 11.06,27.58
$1N6575: length 1.8
  Top Layer w0.2: U3.26 6.62,21.12 6.09,20.59
$1N6636: length 2.6
  Top Layer w0.2: v1(6.09,21.62) U3.25
  Bottom Layer w0.2: v1(6.09,21.62) 5.33,22.38
$1N6899: length 2.9
  Top Layer w0.2: U3.11 13.19,21.62 v1(13.42,21.86)
  Bottom Layer w0.2: 14.87,22.75 14.35,22.75 13.46,21.86 v1(13.42,21.86)
$1N7000: length 2.7
  Top Layer w0.3: v1(13.34,20.85) 13.32,20.86 13.19,20.86 13.18,20.84 13.15,20.84 12.94,20.62 U3.9
  Bottom Layer w0.5: v1(13.34,20.85) 14.61,20.85 14.87,21.1
$1N7110: length 7.3
  Top Layer w0.2: v1(13.34,20.08) 12.46,20.08 U3.8
  Bottom Layer w0.5: 17.15,16.47 16.19,17.42 R19.2 14.74,18.03 R18.2 14.49,20.08 v1(13.34,20.08)

## Copper pours and planes (outline as drawn; the poured copper is in the pictures)
3V3 on Top Layer: 15.37,25.29 15.37,20.21 16.26,19.32 16.26,16.78 16.76,16.27 18.19,16.27 18.19,20.74 19.3,21.86 19.3,25.29
+5V on Top Layer: 18.92,19.45 18.92,16.15 17.91,15.13 13.34,15.13 13.21,15.26 12.7,14.75 12.7,12.72 15.75,12.72 15.75,13.28 17.07,14.6 18.43,14.6 18.54,14.5 18.58,14.5 19.08,13.99 20.57,13.99 20.57,19.32 20.45,19.45
GND on Top Layer: 6.86,36.85 11.68,36.85 11.68,32.4 6.86,32.4
GND on Top Layer: 0,47.52 21.97,47.52 21.97,-1 0,-1
GND on Bottom Layer: -0.13,47.9 20.86,47.9 20.86,-0.66 -0.13,-0.66

## Text on the board
Bottom Silkscreen Layer: 3V3 | 8 | 18 | 17 | 16 | 15 | 7 | 6 | 5 | 1 | 2 | 42 | 41 | 40 | 37 | 35 | 0 | 39 | 38 | 36 | 47 | 21 | 14 | 11 | 10 | 48 | 13 | 12 | 9 | 46 | 3 | 45 | TX | RX | 4
Top Silkscreen Layer: ESP USB | USB TO UART
